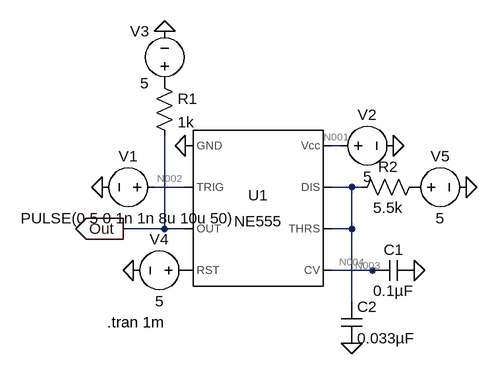
[diagram p0: schematic Lab7.asc]
Lab7.asc, the LTspice schematic file:
Version 4
SHEET 1 880 680
WIRE 352 80 336 80
WIRE 112 144 64 144
WIRE 368 144 336 144
WIRE 384 144 368 144
WIRE 80 208 80 64
WIRE 80 208 16 208
WIRE 112 208 80 208
WIRE 368 208 368 144
WIRE 368 208 336 208
WIRE 400 272 336 272
WIRE 416 272 400 272
WIRE 368 320 368 208
FLAG 112 80 0
FLAG 16 208 Out
IOPIN 16 208 Out
FLAG -16 144 0
FLAG 432 80 0
FLAG 80 -96 0
FLAG 32 272 0
FLAG 544 144 0
FLAG 464 272 0
FLAG 368 384 0
SYMBOL Misc\\NE555 224 176 R0
SYMATTR InstName U1
SYMBOL voltage 80 144 R90
WINDOW 0 -32 56 VBottom 2
WINDOW 3 32 56 VTop 2
WINDOW 123 0 0 Left 0
WINDOW 39 0 0 Left 0
SYMATTR InstName V1
SYMATTR Value PULSE(0 5 0 1n 1n 8u 10u 50)
SYMBOL voltage 336 80 R270
WINDOW 0 32 56 VTop 2
WINDOW 3 -32 56 VBottom 2
SYMATTR InstName V2
SYMATTR Value 5
SYMBOL res 64 -32 R0
SYMATTR InstName R1
SYMATTR Value 1k
SYMBOL voltage 80 0 R180
WINDOW 0 24 96 Left 2
WINDOW 3 24 16 Left 2
SYMATTR InstName V3
SYMATTR Value 5
SYMBOL voltage 128 272 R90
WINDOW 0 -32 56 VBottom 2
WINDOW 3 32 56 VTop 2
SYMATTR InstName V4
SYMATTR Value 5
SYMBOL res 480 128 R90
WINDOW 0 0 56 VBottom 2
WINDOW 3 32 56 VTop 2
SYMATTR InstName R2
SYMATTR Value 5.5k
SYMBOL voltage 448 144 R270
WINDOW 0 32 56 VTop 2
WINDOW 3 -32 56 VBottom 2
SYMATTR InstName V5
SYMATTR Value 5
SYMBOL cap 400 288 R270
WINDOW 0 32 32 VTop 2
WINDOW 3 0 32 VBottom 2
SYMATTR InstName C1
SYMATTR Value 0.1µF
SYMBOL cap 352 320 R0
SYMATTR InstName C2
SYMATTR Value 0.033µF
TEXT -8 352 Left 2 !.tran 1m

The netlist it stands for:
* Lab7.asc
XU1 0 N002 Out P001 N004 N003 N003 N001 NE555  ; pins GND TRIG OUT RST CV THRS DIS Vcc
V1 N002 0 PULSE(0 5 0 1n 1n 8u 10u 50)
V2 N001 0 5
R1 P002 Out 1k
V3 P002 0 5
V4 P001 0 5
R2 P003 N003 5.5k
V5 P003 0 5
C1 N004 0 0.1µF
C2 N003 0 0.033µF
.tran 1m
.lib NE555.sub
.backanno
.end

* Results of the author's LTspice run, read from the files saved beside the schematic
* Operating Point, zero values left out:
*   V(n004) = 3.333 V
*   V(n001) = 5 V
*   V(n003) = 5 V
*   V(out) = 5 V
*   V(p001) = 5 V
*   V(p002) = 5 V
*   V(p003) = 5 V
*   I(R2) = 11.67 nA
*   I(R1) = 29.82 nA
*   I(V5) = -11.67 nA
*   I(V4) = -22.67 µA
*   I(V3) = -29.82 nA
*   I(V2) = -1.588 mA
*   Ix(u1:1) = -1.611 mA
*   Ix(u1:3) = 29.82 nA
*   Ix(u1:4) = 22.67 µA
*   Ix(u1:6) = 5 nA
*   Ix(u1:7) = 6.672 nA
*   Ix(u1:8) = 1.588 mA
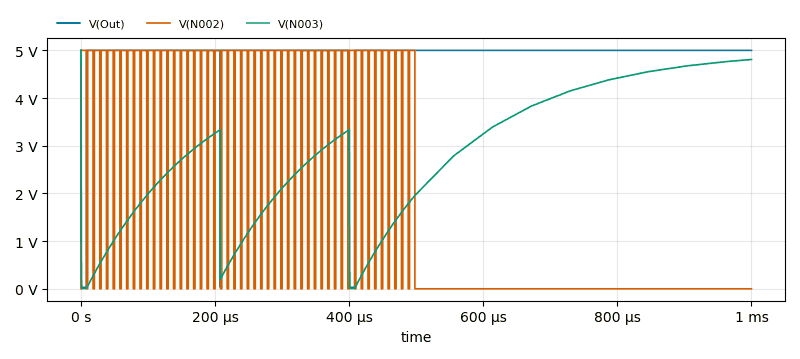
[diagram p1: Transient Analysis of Lab7.asc, plotted from the saved traces]
* Transient Analysis, 1 run:
*   V(Out): min 29.85 mV, max 5 V, average 4.917 V, rms 4.958 V, last 5 V
*   V(N002): min 0 V, max 5 V, average 2 V, rms 3.162 V, last 0 V
*   V(N003): min 5.449 mV, max 5 V, average 2.872 V, rms 3.201 V, last 4.808 V